# EAGLE design blank_rev_1 (EAGLE 6.3)
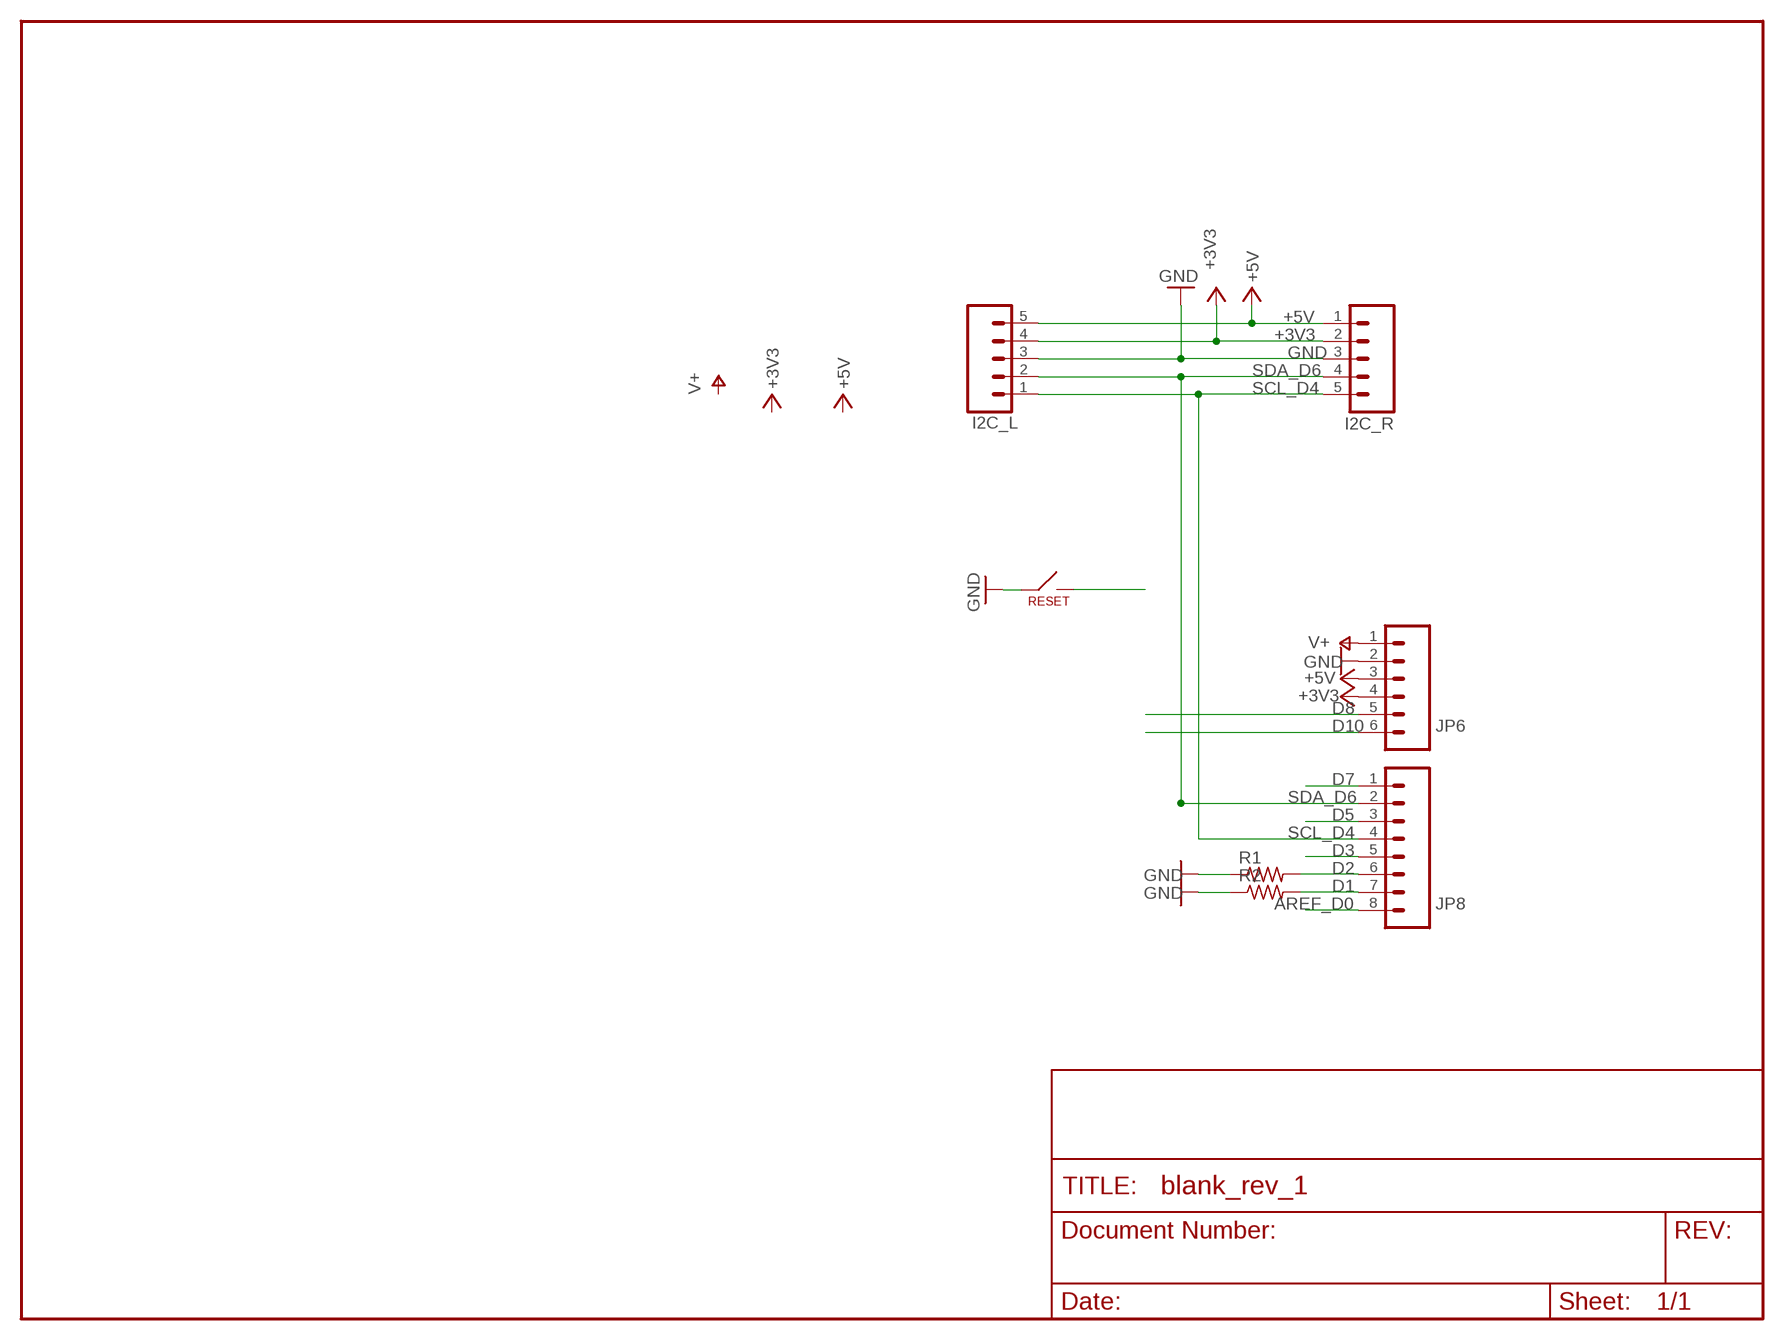
[diagram p0: schematic, sheet 1]

## Parts
I2C_L  M05PTH  [1X05]
I2C_R  M05PTH  [1X05]
JP6  M06SIP  [1X06]
JP8  M081X08  [1X08]
R1  R-US_0204/2V  [0204V]
R2  R-US_0204/2V  [0204V]
RESET  PTS635_SWITCH  [PTS635_SWITCH]

## Nets
+3V3: I2C_L.4 I2C_R.2 JP6.4
+5V: I2C_L.5 I2C_R.1 JP6.3
AREF_D0: JP8.8
D1: JP8.7 R2.2
D2: JP8.6 R1.2
D3: JP8.5
D5: JP8.3
D7: JP8.1
D8: JP6.5
D10: JP6.6
GND: I2C_L.3 I2C_R.3 JP6.2 R1.1 R2.1 RESET.P$1
RESET: RESET.P$2
SCL_D4: I2C_L.1 I2C_R.5 JP8.4
SDA_D6: I2C_L.2 I2C_R.4 JP8.2
V+: JP6.1

## Library data of the parts
I2C_L I2C_R = SparkFun_mod:M05: Header 5 Standard 5-pin 0.1" header. Use with straight break away headers (SKU : PRT-00116), right angle break away headers (PRT-00553), swiss pins (PRT-00743), machine pins (PRT-00117), and female headers (PRT-00115). Molex polarized connector foot print use with SKU : PRT-08230 with associated crimp pins and housings.
JP6 = SparkFun:M06: Header 6 Standard 6-pin 0.1" header. Use with straight break away headers (SKU : PRT-00116), right angle break away headers (PRT-00553), swiss pins (PRT-00743), machine pins (PRT-00117), and female headers (PRT-00115). Molex polarized connector foot print use with SKU : PRT-08094 with associated crimp pins and housings. NOTES ON THE VARIANTS LOCK and LOCK_LONGPADS... This footprint was designed to help hold the alignment of a through-hole component (i.e. 6-pin header) while soldering it into place. You may notice that each hole has been shifted either up or down by 0.005 of an inch from it's more standard position (which is a perfectly straight line). This slight alteration caused the pins (the squares in the middle) to touch the edges of the holes. Because they are alternating, it causes a "brace" to hold the component in place. 0.005 has proven to be the perfect amount of "off-center" position when using our standard breakaway headers. Although looks a little odd when you look at the bare footprint, once you have a header in there, the alteration is very hard to notice. Also, if you push a header all the way into place, it is covered up entirely on the bottom side. This idea of altering the position of holes to aid alignment will be further integrated into the Sparkfun Library for other footprints. It can help hold any component with 3 or more connection pins.
JP8 = SparkFun:M08: Header 8 Standard 8-pin 0.1" header. Use with straight break away headers (SKU : PRT-00116), right angle break away headers (PRT-00553), swiss pins (PRT-00743), machine pins (PRT-00117), and female headers (PRT-00115).
R1 R2 = adafruit_mod:R-US_: RESISTOR, American symbol
RESET = _my-parts:PTS635_SWITCH: www.ck-components.com

## Board
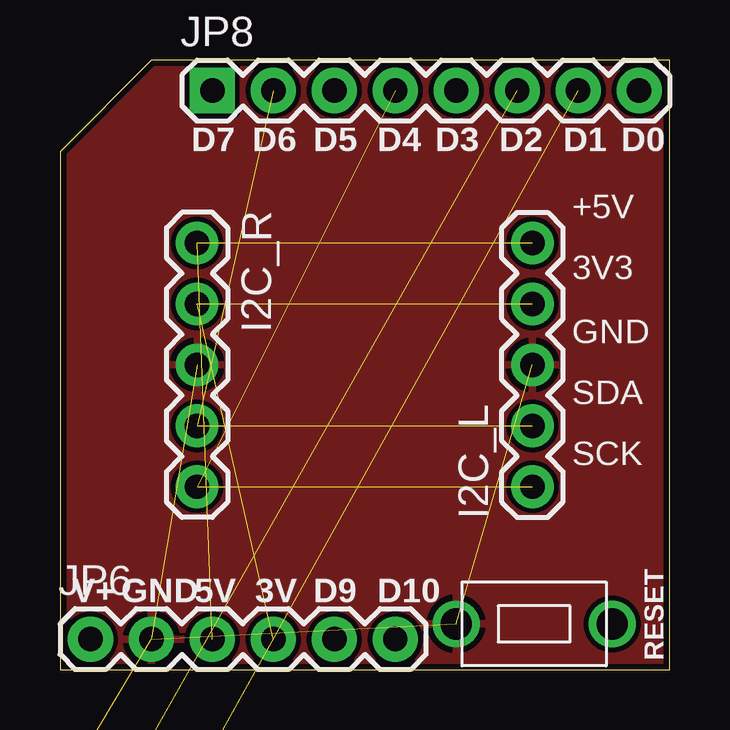
[diagram p1: board, top side]
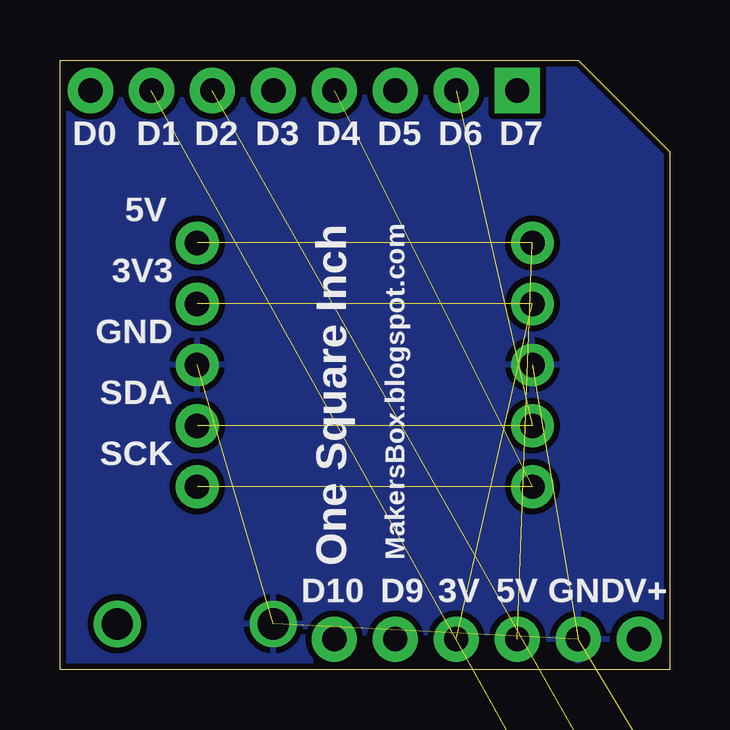
[diagram p2: board, bottom side, seen from below]

Size 25.4 x 25.4 mm. Coordinates in mm from the lower left corner, seen from the top.
Outline: 25.4,25.4 25.4,21.59 25.4,0 24.77,0 24.77,0 0,0 0,21.59
Outline: 25.4,25.4 3.81,25.4 0,21.59
Outline: 0,21.59 0,21.59
Copper layers (1*16): Top 0.035mm / dielectric 1.5mm / Bottom 0.035mm
Design rules "SparkFun": minimum track width 8mil, minimum drill 20mil, track to track 8mil, track to pad 8mil, pad to pad 8mil, via to via 8mil, smd to smd 8mil, copper to edge 10mil, drill to drill 8mil, minimum pad ring 12mil, minimum via ring 10mil, stop-mask expansion 4mil, vias tented up to drill 25mil, thermal gap 10mil

### Footprints (pad centres in the part's own frame; a part is rotated, then mirrored left to right if it is on the bottom)
1X05 = drill 1.016 pad 1.778: 1 0,0; 2 2.54,0; 3 5.08,0; 4 7.62,0; 5 10.16,0
1X06 = drill 1.016 pad 1.88: 1 0,0; 2 2.54,0; 3 5.08,0; 4 7.62,0; 5 10.16,0; 6 12.7,0
1X08 = drill 1.016 pad 1.88 square: 1 0,0 | drill 1.016 pad 1.88: 2 2.54,0; 3 5.08,0; 4 7.62,0; 5 10.16,0; 6 12.7,0; 7 15.24,0; 8 17.78,0
0204V = drill 0.813 octagon: 1 -1.27,0; 2 1.27,0
PTS635_SWITCH = drill 1.3: P$1 0,0; P$2 6.5,0

### Placement (x,y rotation side)
I2C_L  19.68,7.62 90 top
I2C_R  5.71,17.78 270 top
JP6  1.27,1.27 0 top
JP8  6.35,24.13 0 top
R1  1.27,-5.08 0 top  (outside the outline)
R2  1.27,-10.16 0 top  (outside the outline)
RESET  16.51,1.91 0 top

### Tracks (layer width: path | path; a pad name or v marks a point on that pad's centre or on a via)
+3V3  (2 unrouted)
+5V  (2 unrouted)
D1  (1 unrouted)
D2  (1 unrouted)
GND  (5 unrouted)
  pour Bottom (isolate 0.254): -1.27,26.67 26.67,26.67 26.67,-1.27 -1.27,-1.27
  pour Top: -0.64,26.04 26.67,26.04 26.67,0 26.04,-0.64 -0.64,-0.64
SCL_D4  (2 unrouted)
SDA_D6  (2 unrouted)

### Text on the board
tPlace: D7 | D6 | D5 | D4 | D3 | D2 | D1 | D0 | BRAIN | +5V | 3V3 | GND | SDA | SCK | V+ | GND | 5V | 3V | D9 | D10 | RESET
bPlace: D7 | D6 | D5 | D4 | D3 | D2 | D1 | D0 | 5V | Brain / Rev 1 / Feb 12 | 3V3 | GND | SDA | SCK | MakersBox.blogspot.com | One Square Inch | V+ | GND | 5V | 3V | D9 | D10